# Altium schematic sheet Nucleo_Pb_Buzzer.SchDoc: Emeleserzekelo
size A4; Author: Nyitrai Bence; Organization: BME-AUT; DocumentNumber: 2; Revision: A3; SheetNumber: 2; SheetTotal: 2
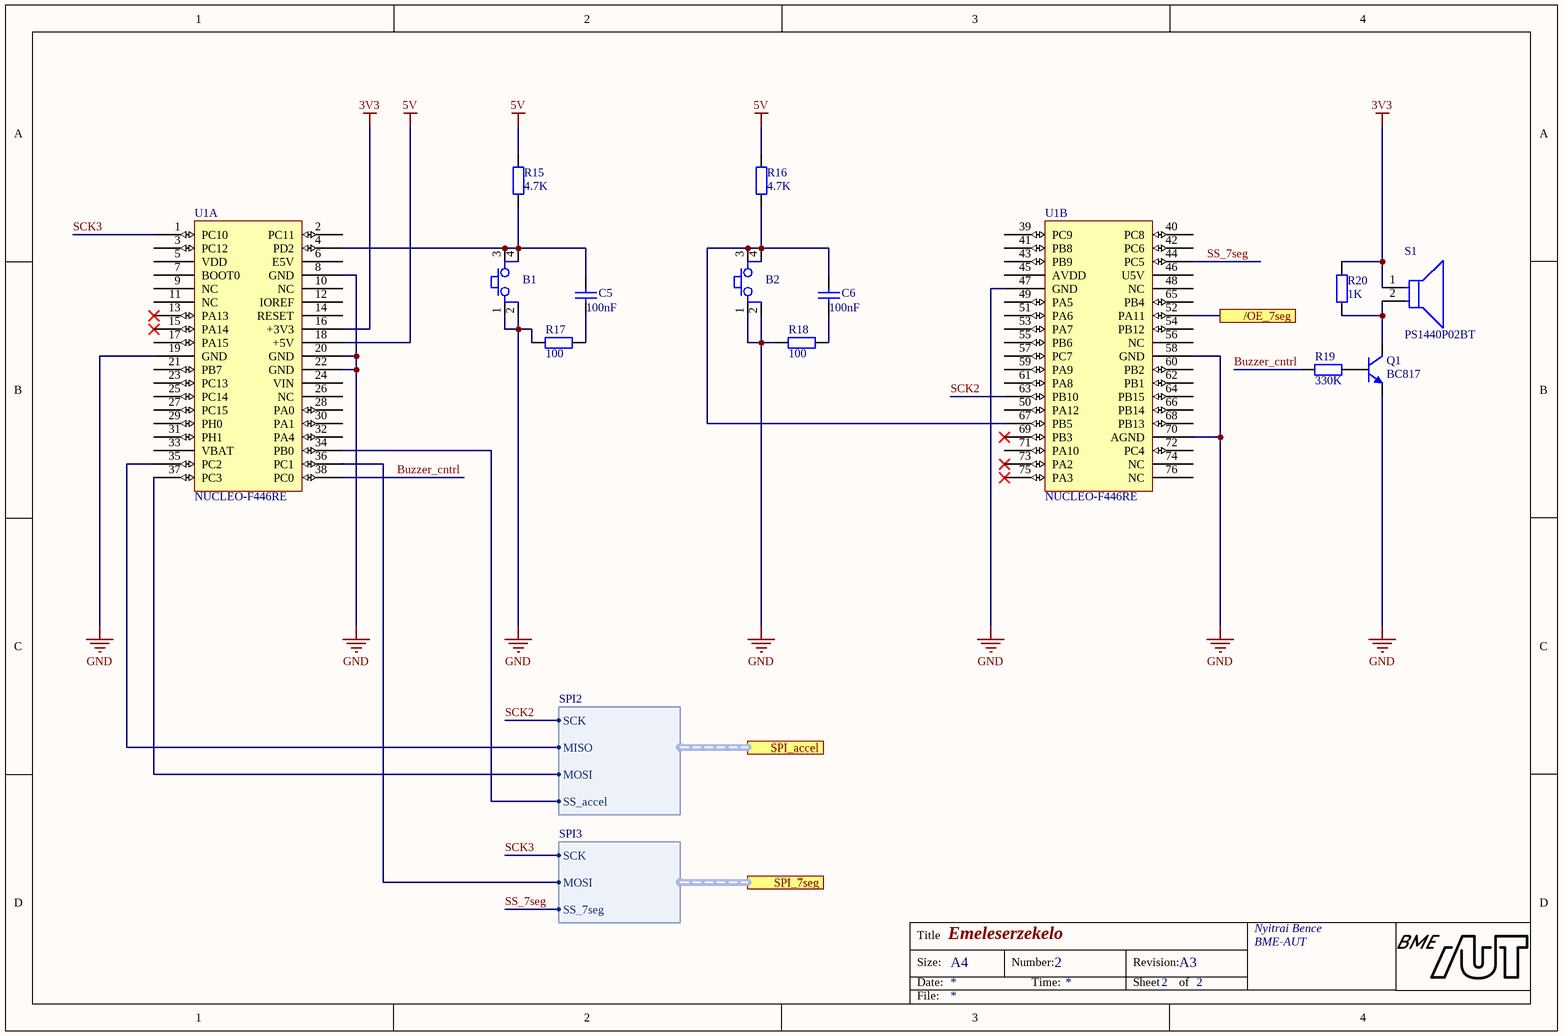
[diagram p0: Nucleo_Pb_Buzzer.SchDoc]

## Parts
B1  Button  [FP_BTN_SMD]  (value not drawn)
B2  Button  [FP_BTN_SMD]  (value not drawn)
C5  100nF  [FP_0805_CAP_085]
C6  100nF  [FP_0805_CAP_085]
Q1  BC817  [FP_SOT23-3]
R15  4.7K  [FP_0805_RES]
R16  4.7K  [FP_0805_RES]
R17  100  [FP_0805_RES]
R18  100  [FP_0805_RES]
R19  330K  [FP_0805_RES]
R20  1K  [FP_0805_RES]
S1  PS1440P02BT  [FP-PS1440P02BT-MFG]
U1  NUCLEO-F446RE  [FP_NUCLEO-64_2x20]  (parts A,B of 2)

## Ports
/OE_7seg, SPI_7seg (harness SPI3), SPI_accel (harness SPI2)

## Harnesses
SPI2: MISO, SCK, MOSI, SS_accel
SPI3: MOSI, SCK, SS_7seg

## Nets
3V3: R20.2 S1.1 U1.16(+3V3)
5V: R15.2 R16.2 U1.18(+5V)
GND: B1.1 B1.2 B2.1 B2.2 Q1.2(E) R17.1 R18.1 U1.8(GND) U1.19(GND) U1.20(GND) U1.22(GND) U1.47(GND) U1.58(GND) U1.70(AGND)
/OE_7seg: U1.52(PA11) ; port /OE_7seg
Buzzer_cntrl: R19.1 U1.38(PC0)
SCK2: U1.63(PB10) ; port SPI_accel.SCK
SCK3: U1.1(PC10) ; port SPI_7seg.SCK
SS_7seg: U1.44(PC5) ; port SPI_7seg.SS_7seg
NetB1_3: B1.3 B1.4 C5.2 R15.1 U1.4(PD2)
NetB2_3: B2.3 B2.4 C6.2 R16.1 U1.67(PB5)
NetC5_1: C5.1 R17.2
NetC6_1: C6.1 R18.2
NetQ1_1: Q1.1(B) R19.2
NetQ1_3: Q1.3(C) R20.1 S1.2
NetU1_34: U1.34(PB0) ; port SPI_accel.SS_accel
NetU1_35: U1.35(PC2) ; port SPI_accel.MISO
NetU1_36: U1.36(PC1) ; port SPI_7seg.MOSI
NetU1_37: U1.37(PC3) ; port SPI_accel.MOSI

Not connected (* = marked no-connect by the designer): U1 2(PC11) 3(PC12) 5(VDD) 6(E5V) 7(BOOT0) 9(NC) 10(NC) 11(NC) 12(IOREF) 13(PA13)* 14(RESET) 15(PA14)* 17(PA15) 21(PB7) 23(PC13) 24(VIN) 25(PC14) 26(NC) 27(PC15) 28(PA0) 29(PH0) 30(PA1) 31(PH1) 32(PA4) 33(VBAT) 39(PC9) 40(PC8) 41(PB8) 42(PC6) 43(PB9) 45(AVDD) 46(U5V) 48(NC) 49(PA5) 50(PA12) 51(PA6) 53(PA7) 54(PB12) 55(PB6) 56(NC) 57(PC7) 59(PA9) 60(PB2) 61(PA8) 62(PB1) 64(PB15) 65(PB4) 66(PB14) 68(PB13) 69(PB3)* 71(PA10) 72(PC4) 73(PA2)* 74(NC) 75(PA3)* 76(NC)

## Notes on the sheet
- Title
- Size:
- Date:
- A4
- Number:
- Time:
- Revision:
- Sheet
- of
- File:

## Library data of the parts
B1 B2 = Button 4P: Push button; Name: TACT 6x 6 4P SPST 2 FSM4JSMA 4-1437565-1 (TYC) 50mA 12VDC SMD H=5mm 160g BLACK HEAD; Reference: 45-05-43; Supplier: Lomex
C5 C6 = CAP: Capacitor; Name: 100nF 0805 10% 50V X7R 0805B104K500CT (WAL); Supplier: Lomex; Reference: 82-10-76; Value: 100nF
Q1 = BC817: NPN General-purpose Transistor; Reference: 506308; Name: BC817-40; ComponentLink1Description: Manufacturer Link; ComponentLink1URL: http://www.semiconductors.philips.com/; ComponentLink2Description: Datasheet; ComponentLink2URL: http://www.semiconductors.philips.com/acrobat/datasheets/BC817_BC817W_BC337_5.pdf; Supplier: Farnell
R15 R16 = RES: Resistor; Power: 125 mW; Name: 4K70 0805 5% RS-05K472JT 0.125W (FNG); Supplier: Lomex; Reference: 81-35-61; Value: 4.7K
R17 R18 = RES: Resistor; Power: 125 mW; Name: 100R 0805 5% RC0805JR-10100RL 0.125W (YAG); Reference: [81-34-71; Supplier: Lomex; Value: 100
R19 = RES: Resistor; Power: 125 mW; Name: 330K 0805 5% CR-05JL7--330K 0.125W (VIK); Supplier: Lomex; Reference: 81-11-16; Value: 330K
R20 = RES: Resistor; Power: 125 mW; Name: 1K00 0805 5% CR-05JL7----1K 0.125W (VIK); Supplier: Lomex; Reference: 81-10-87; Value: 1K
S1 = PS1440P02BT: AUDIO PIEZO TRANSDUCER 30V TH; Reference: 3212600; Supplier: Farnell; Name: PS1440P02BT
U1 = NUCLEO-F446RE: Reference: NUCLEO; Name: Nucleo F446RE; Supplier: Tanszék